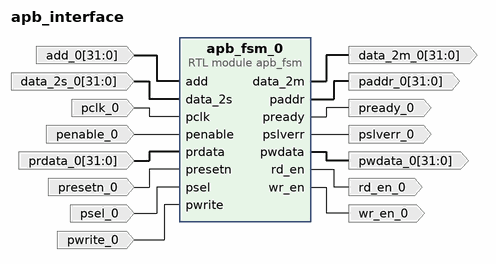
[diagram p0: block diagram of the top level]
# Vivado block design apb_interface, xczu7ev-ffvc1156-2-e, Vivado 2025.1
create_bd_design apb_interface

create_bd_port -dir I -from 31 -to 0 add_0
create_bd_port -dir O -from 31 -to 0 data_2m_0
create_bd_port -dir I -from 31 -to 0 data_2s_0
create_bd_port -dir O -from 31 -to 0 paddr_0
create_bd_port -dir I pclk_0
create_bd_port -dir I penable_0
create_bd_port -dir I -from 31 -to 0 prdata_0
create_bd_port -dir O pready_0
create_bd_port -dir I presetn_0
create_bd_port -dir I psel_0
create_bd_port -dir O pslverr_0
create_bd_port -dir O -from 31 -to 0 pwdata_0
create_bd_port -dir I pwrite_0
create_bd_port -dir O rd_en_0
create_bd_port -dir O wr_en_0

create_bd_cell -type module -reference apb_fsm apb_fsm_0

# ---- connections ----

connect_bd_net -net add_0_1 [get_bd_ports add_0] [get_bd_pins apb_fsm_0/add]
connect_bd_net [get_bd_pins apb_fsm_0/data_2m] [get_bd_ports data_2m_0]
connect_bd_net [get_bd_pins apb_fsm_0/paddr] [get_bd_ports paddr_0]
connect_bd_net [get_bd_pins apb_fsm_0/pready] [get_bd_ports pready_0]
connect_bd_net [get_bd_pins apb_fsm_0/pslverr] [get_bd_ports pslverr_0]
connect_bd_net [get_bd_pins apb_fsm_0/pwdata] [get_bd_ports pwdata_0]
connect_bd_net [get_bd_pins apb_fsm_0/rd_en] [get_bd_ports rd_en_0]
connect_bd_net [get_bd_pins apb_fsm_0/wr_en] [get_bd_ports wr_en_0]
connect_bd_net -net data_2s_0_1 [get_bd_ports data_2s_0] [get_bd_pins apb_fsm_0/data_2s]
connect_bd_net -net pclk_0_1 [get_bd_ports pclk_0] [get_bd_pins apb_fsm_0/pclk]
connect_bd_net -net penable_0_1 [get_bd_ports penable_0] [get_bd_pins apb_fsm_0/penable]
connect_bd_net -net prdata_0_1 [get_bd_ports prdata_0] [get_bd_pins apb_fsm_0/prdata]
connect_bd_net -net presetn_0_1 [get_bd_ports presetn_0] [get_bd_pins apb_fsm_0/presetn]
connect_bd_net -net psel_0_1 [get_bd_ports psel_0] [get_bd_pins apb_fsm_0/psel]
connect_bd_net -net pwrite_0_1 [get_bd_ports pwrite_0] [get_bd_pins apb_fsm_0/pwrite]

validate_bd_design
save_bd_design
